# Altium schematic sheet top_level.SchDoc
size A4
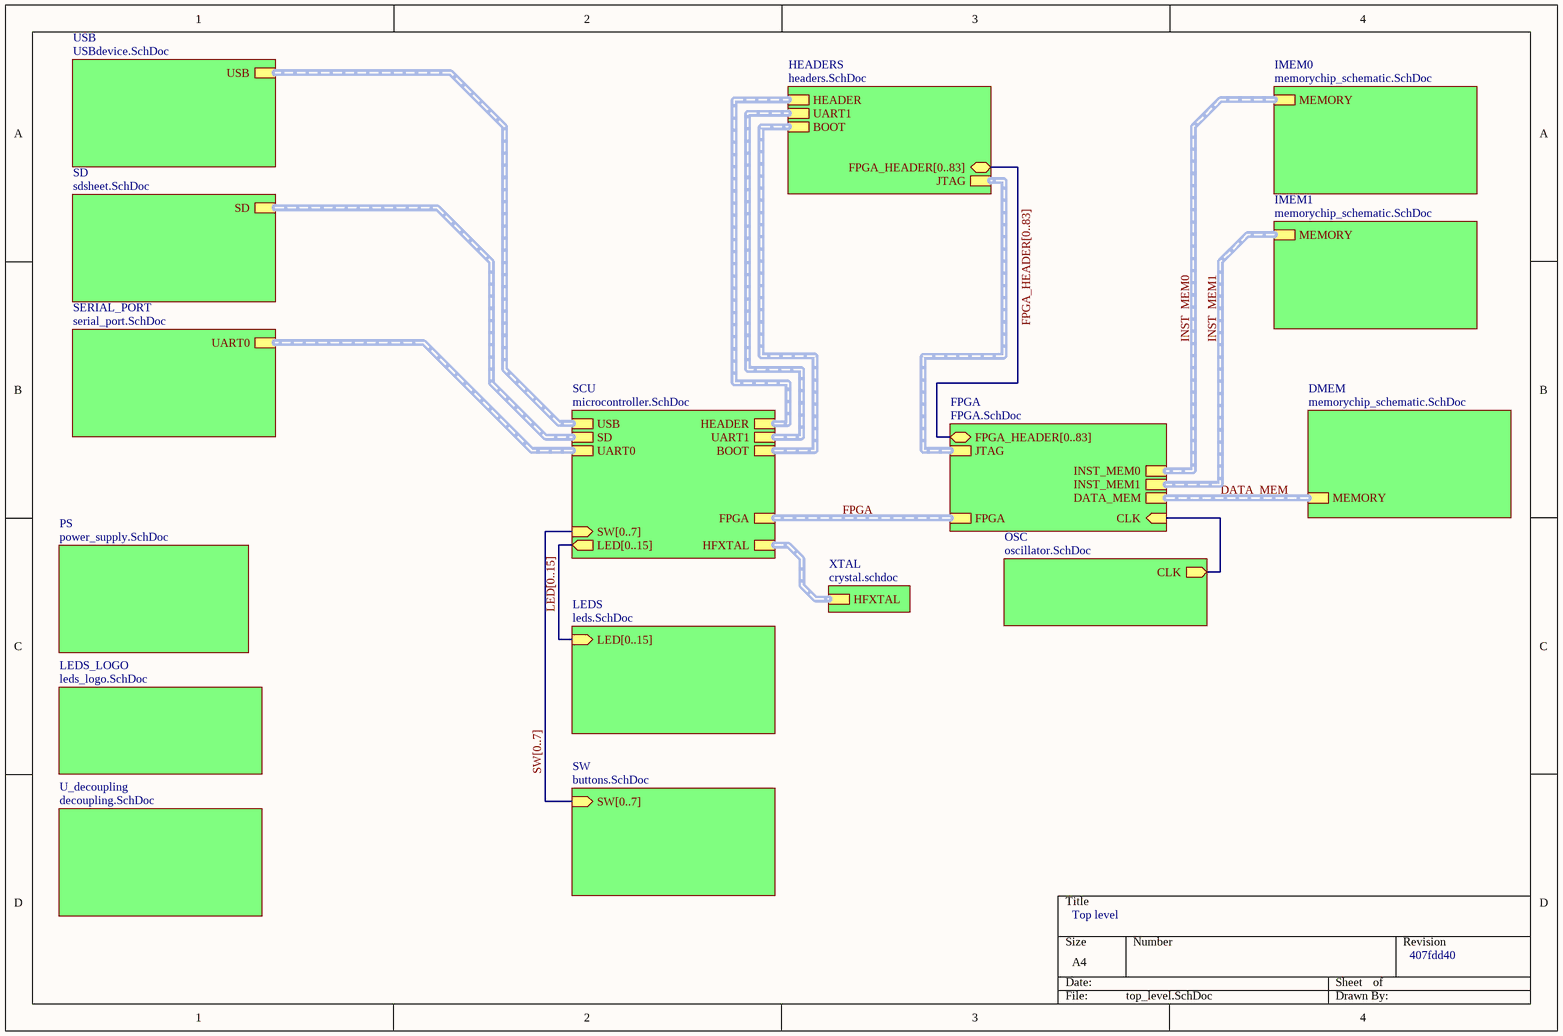
[diagram p0: top_level.SchDoc]

## Sub-sheets
DMEM = memorychip_schematic.SchDoc: MEMORY (harness MEMORY)
FPGA = FPGA.SchDoc: FPGA (harness FPGA), DATA_MEM (harness MEMORY), INST_MEM0 (harness MEMORY), INST_MEM1 (harness MEMORY), JTAG (harness FPGA JTAG), CLK (in), FPGA_HEADER[0..83] (bidir)
HEADERS = headers.SchDoc: FPGA_HEADER[0..83] (bidir), UART1 (harness UART1), BOOT (harness BOOT), HEADER (harness HEADER), JTAG (harness FPGA JTAG)
IMEM0 = memorychip_schematic.SchDoc: MEMORY (harness MEMORY)
IMEM1 = memorychip_schematic.SchDoc: MEMORY (harness MEMORY)
LEDS = leds.SchDoc: LED[0..15] (in)
LEDS_LOGO = leds_logo.SchDoc: no entries
OSC = oscillator.SchDoc: CLK (out)
PS = power_supply.SchDoc: no entries
SCU = microcontroller.SchDoc: SW[0..7] (in), LED[0..15] (out), UART0 (harness UART0), FPGA (harness FPGA), HFXTAL (harness HFXTAL), UART1 (harness UART1), USB (harness USB), BOOT (harness BOOT), SD (harness SD), HEADER (harness HEADER)
SD = sdsheet.SchDoc: SD (harness SD)
SERIAL_PORT = serial_port.SchDoc: UART0 (harness UART0)
SW = buttons.SchDoc: SW[0..7] (in)
U_decoupling = decoupling.SchDoc: no entries
USB = USBdevice.SchDoc: USB (harness USB)
XTAL = crystal.schdoc: HFXTAL (harness HFXTAL)

## Nets
(unnamed): sheet FPGA/CLK, sheet OSC/CLK

## Buses and harness runs
bus FPGA_HEADER[0..83] = sheet FPGA/FPGA_HEADER[0..83] = sheet HEADERS/FPGA_HEADER[0..83]
bus LED[0..15] = sheet LEDS/LED[0..15] = sheet SCU/LED[0..15]
bus SW[0..7] = sheet SCU/SW[0..7] = sheet SW/SW[0..7]
harness DATA_MEM = sheet DMEM/MEMORY = sheet FPGA/DATA_MEM
harness FPGA = sheet FPGA/FPGA = sheet SCU/FPGA
harness INST_MEM0 = sheet FPGA/INST_MEM0 = sheet IMEM0/MEMORY
harness INST_MEM1 = sheet FPGA/INST_MEM1 = sheet IMEM1/MEMORY
harness sheet FPGA/JTAG = sheet HEADERS/JTAG
harness sheet HEADERS/BOOT = sheet SCU/BOOT
harness sheet HEADERS/HEADER = sheet SCU/HEADER
harness sheet HEADERS/UART1 = sheet SCU/UART1
harness sheet SCU/HFXTAL = sheet XTAL/HFXTAL
harness sheet SCU/SD = sheet SD/SD
harness sheet SCU/UART0 = sheet SERIAL_PORT/UART0
harness sheet SCU/USB = sheet USB/USB

## Notes on the sheet
- Top level
- 407fdd40